# EAGLE schematic schematicEagle (EAGLE 9.6.2)
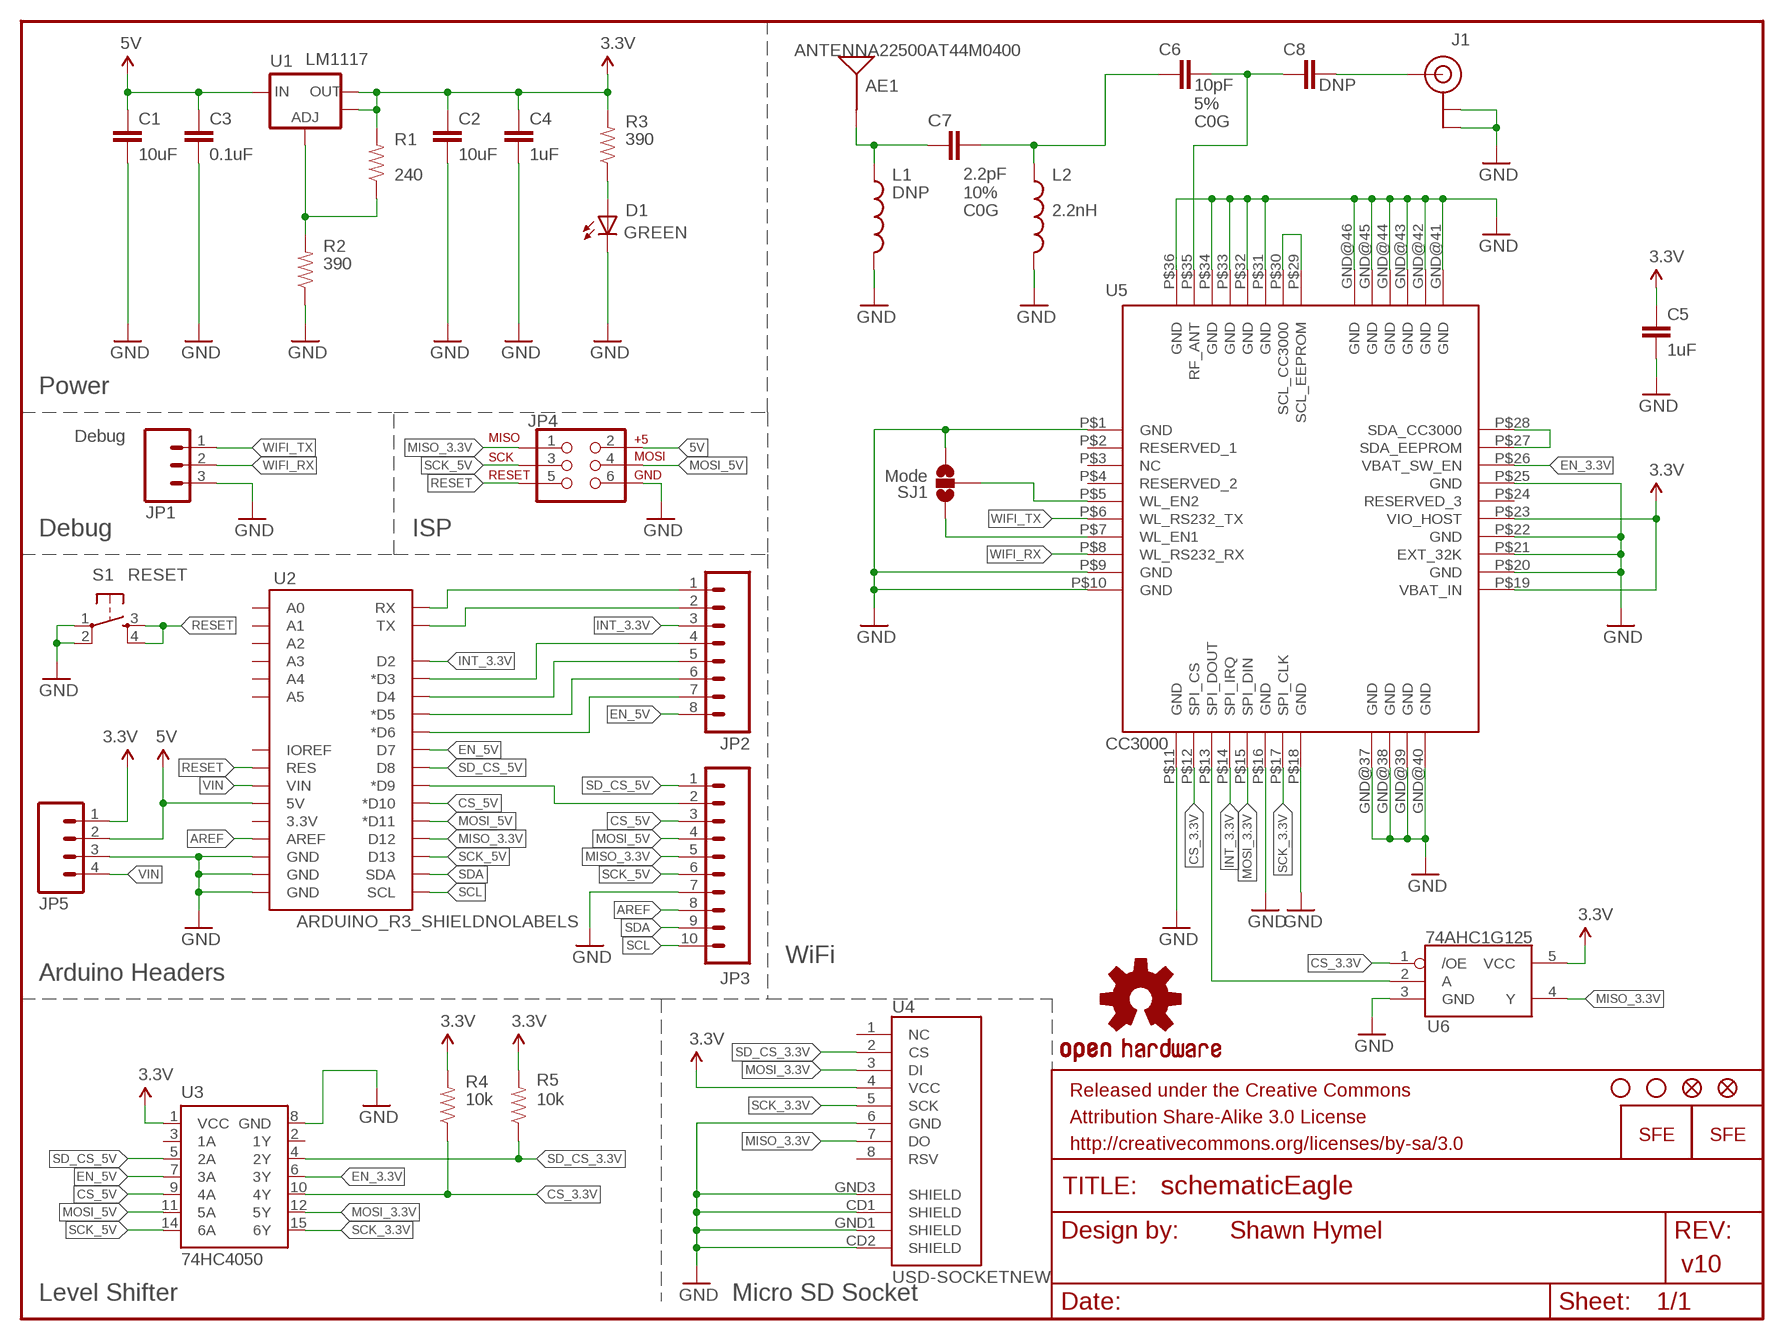
[diagram p0: schematic, sheet 1]

## Parts
AE1  ANTENNA22500AT44M0400  [ANTENNA-CHIP_2500AT44M0400]
C1  10uF  CAP0805  [0805]
C2  10uF  CAP0805  [0805]
C3  0.1uF  CAP0603-CAP  [0603-CAP]
C4  1uF  CAP0805  [0805]
C5  1uF  CAP0805  [0805]
C6  10pF  CAP0603-CAP  [0603-CAP]
C7  2.2pF  CAP0603-CAP  [0603-CAP]
C8  DNP  CAP0603-CAP  [0603-CAP]
D1  GREEN  LED-GREEN0603  [LED-0603]
FID1  FIDUCIAL1X2  [FIDUCIAL-1X2]
FID2  FIDUCIAL1X2  [FIDUCIAL-1X2]
FRAME1  FRAME-LETTER  [CREATIVE_COMMONS]
J1  U.FL  [U.FL]
JP1  Debug  M03PTH  [1X03]
JP2  M08NO_SILK  [1X08_NO_SILK]
JP3  M10NO_SILK  [1X10_NO_SILK]
JP4  AVR_SPI_PRG_6PTH  [2X3]
JP5  M04PTH  [1X04]
L1  DNP  INDUCTOR0603  [0603]
L2  2.2nH  INDUCTOR0603  [0603]
LOGO1  OSHW-LOGOS  [OSHW-LOGO-S]
LOGO2  LOGO-SFENEW  [SFE-NEW-WEBLOGO]
LOGO3  LOGO-SFESK  [SFE-LOGO-FLAME]
R1  240  RESISTOR0603  [0603-RES]
R2  390  RESISTOR0603  [0603-RES]
R3  390  RESISTOR0603-RES  [0603-RES]
R4  10k  RESISTOR0603-RES  [0603-RES]
R5  10k  RESISTOR0603-RES  [0603-RES]
S1  RESET  TAC_SWITCHSMD  [TACTILE_SWITCH_SMD]
SJ1  Mode  SOLDERJUMPER_2WAYPASTE1&2  [SJ_3_PASTE1&2]
STANDOFF1  STAND-OFF  [STAND-OFF]
STANDOFF2  STAND-OFF  [STAND-OFF]
U1  LM1117  V_REG_LM1117SOT223  [SOT223]
U2  ARDUINO_R3_SHIELDNOLABELS  [UNO_R3_SHIELD_NOLABELS]
U3  74HC4050  HEX_CONVERTER  [SO016]
U4  USD-SOCKETNEW  [MICRO-SD-SOCKET-PP]
U5  CC3000  [QFN-46_CC3000]
U6  74AHC1G125  [SOT23-5]

## Nets
3.3V: C2.1 C4.1 C5.1 JP5.1 R1.2 R3.2 R4.2 R5.2 U1.2(OUT) U1.4(OUT) U3.1(VCC) U4.4(VCC) U5.P$19(VBAT_IN) U5.P$23(VIO_HOST) U6.5(VCC)
5V: C1.1 C3.1 JP4.2 JP5.2 U1.3(IN) U2.5V
AREF: JP3.8 U2.AREF
CS_3.3V: R4.1 U3.10(4Y) U5.P$12(SPI_CS) U6.1(/OE)
CS_5V: JP3.3 U2.D10(*D10) U3.9(4A)
EN_3.3V: U3.6(3Y) U5.P$26(VBAT_SW_EN)
EN_5V: JP2.8 U2.D7 U3.7(3A)
GND: C1.2 C2.2 C3.2 C4.2 C5.2 D1.C J1.P$1(GND) J1.P$2(GND) JP1.3 JP3.7 JP4.6 JP5.3 L1.2 L2.2 R2.1 S1.1 S1.2 SJ1.3 U2.GND@0(GND) U2.GND@1(GND) U2.GND@2(GND) U3.8(GND) U4.6(GND) U4.CD1(SHIELD) U4.CD2(SHIELD) U4.GND1(SHIELD) U4.GND3(SHIELD) U5.GND@37(GND) U5.GND@38(GND) U5.GND@39(GND) U5.GND@40(GND) U5.GND@41(GND) U5.GND@42(GND) U5.GND@43(GND) U5.GND@44(GND) U5.GND@45(GND) U5.GND@46(GND) U5.P$1(GND) U5.P$9(GND) U5.P$10(GND) U5.P$11(GND) U5.P$16(GND) U5.P$18(GND) U5.P$20(GND) U5.P$21(EXT_32K) U5.P$22(GND) U5.P$25(GND) U5.P$31(GND) U5.P$32(GND) U5.P$33(GND) U5.P$34(GND) U5.P$36(GND) U6.3(GND)
INT_3.3V: JP2.3 U2.D2 U5.P$14(SPI_IRQ)
MISO_3.3V: JP3.5 JP4.1 U2.D12 U4.7(DO) U6.4(Y)
MOSI_3.3V: U3.12(5Y) U4.3(DI) U5.P$15(SPI_DIN)
MOSI_5V: JP3.4 JP4.4 U2.D11(*D11) U3.11(5A)
N$2: R1.1 R2.2 U1.1(ADJ)
N$3: SJ1.2 U5.P$5(WL_EN2)
N$4: SJ1.1 U5.P$7(WL_EN1)
N$5: C6.1 C7.2 L2.1
N$6: U5.P$27(SDA_EEPROM) U5.P$28(SDA_CC3000)
N$7: U5.P$29(SCL_EEPROM) U5.P$30(SCL_CC3000)
N$8: C6.2 C8.1 U5.P$35(RF_ANT)
N$9: C8.2 J1.P$3(SIGNAL)
N$10: AE1.FEED(SIGNAL) C7.1 L1.1
N$11: D1.A R3.1
N$125: JP2.1 U2.RX
N$126: JP2.2 U2.TX
N$127: JP2.4 U2.D3(*D3)
N$128: JP2.6 U2.D5(*D5)
N$129: JP2.7 U2.D6(*D6)
N$130: JP2.5 U2.D4
N$131: JP3.2 U2.D9(*D9)
RESET: JP4.5 S1.3 S1.4 U2.RES
SCK_3.3V: U3.15(6Y) U4.5(SCK) U5.P$17(SPI_CLK)
SCK_5V: JP3.6 JP4.3 U2.D13 U3.14(6A)
SCL: JP3.10 U2.SCL
SD_CS_3.3V: R5.1 U3.4(2Y) U4.2(CS)
SD_CS_5V: JP3.1 U2.D8 U3.5(2A)
SDA: JP3.9 U2.SDA
VIN: JP5.4 U2.VIN
WIFI_MISO: U5.P$13(SPI_DOUT) U6.2(A)
WIFI_RX: JP1.2 U5.P$8(WL_RS232_RX)
WIFI_TX: JP1.1 U5.P$6(WL_RS232_TX)
Unconnected: U2.3.3V U2.A0 U2.A1 U2.A2 U2.A3 U2.A4 U2.A5 U2.IOREF U3.2(1Y) U3.3(1A) U4.1(NC) U4.8(RSV) U5.P$2(RESERVED_1) U5.P$3(NC) U5.P$4(RESERVED_2) U5.P$24(RESERVED_3)

## Notes on the sheet
- Power
- Debug | ISP
- WiFi
- Arduino Headers
- Shawn Hymel
- v10
- Level Shifter | Micro SD Socket

## Library data of the parts
AE1 = SparkFun-RF:ANTENNA2: Chip antenna Single endded antenna. Common with smaller chip antennas. CHIP4 package is the GPS Chip Antenna SKU: GPS-08418. CHIP5 package is 2.4GHz chip antenna SKU: WRL-00144.
C1-C5 C8 = SparkFun-Capacitors:CAP: Capacitor Standard 0603 ceramic capacitor, and 0.1" leaded capacitor.
C6 = SparkFun-Capacitors:CAP: Capacitor Standard 0603 ceramic capacitor, and 0.1" leaded capacitor.; COEFF: C0G; TOL: 5%
C7 = SparkFun-Capacitors:CAP: Capacitor Standard 0603 ceramic capacitor, and 0.1" leaded capacitor.; COEFF: C0G; TOL: 10%
D1 = SparkFun-LED:LED-GREEN: Various green LEDs 0603- DIO-00821 LARGE- DIO-00862 LILYPAD- DIO-09910; PROD_ID: DIO-00821
FID1 FID2 = SparkFun-Aesthetics:FIDUCIAL: Fiducial Alignment Points Various fiducial points for machine vision alignment.
FRAME1 = SparkFun-Aesthetics:FRAME-LETTER: Schematic Frame Standard 8.5x11 US Letter frame
J1 = SparkFun-Connectors:U.FL: SMD antenna connector- WRL-09144
JP1 = SparkFun-Connectors:M03: Header 3 Standard 3-pin 0.1" header. Use with straight break away headers (SKU : PRT-00116), right angle break away headers (PRT-00553), swiss pins (PRT-00743), machine pins (PRT-00117), and female headers (PRT-00115). Molex polarized connector foot print use with SKU : PRT-08232 with associated crimp pins and housings.
JP2 = SparkFun-Connectors:M08: Header 8 Standard 8-pin 0.1" header. Use with straight break away headers (SKU : PRT-00116), right angle break away headers (PRT-00553), swiss pins (PRT-00743), machine pins (PRT-00117), and female headers (PRT-00115).
JP3 = SparkFun-Connectors:M10: Header 10 Standard 10-pin 0.1" header. Use with straight break away headers (SKU : PRT-00116), right angle break away headers (PRT-00553), swiss pins (PRT-00743), machine pins (PRT-00117), and female headers (PRT-00115).
JP4 = SparkFun-Connectors:AVR_SPI_PRG_6: AVR ISP 6 Pin This is the reduced ISP connector for AVR programming. Common on Arduino. This footprint will take up less PCB space and can be used with a 10-pin to 6-pin adapter such as SKU: BOB-08508
JP5 = SparkFun-Connectors:M04: Header 4 Standard 4-pin 0.1" header. Use with straight break away headers (SKU : PRT-00116), right angle break away headers (PRT-00553), swiss pins (PRT-00743), machine pins (PRT-00117), and female headers (PRT-00115). Molex polarized connector foot print use with SKU : PRT-08231 with associated crimp pins and housings. 1MM SMD Version SKU: PRT-10208
L1 L2 = SparkFun-Passives:INDUCTOR: Inductors Basic Inductor/Choke - 0603 and 1206. Footprints are not proven and vary greatly between part numbers. SRN6045- 33uH, 20% 1.4A SDR0403-560KL - 56uH, 10%, 500mA RMS/740mA peak
LOGO1 = SparkFun-Aesthetics:OSHW-LOGO: Open Source Hardware Logo This logo indicates the piece of hardware it is found on incorporates a OSHW license and/or adheres to the definition of open source hardware found here: http://freedomdefined.org/OSHW
LOGO2 LOGO3 = SparkFun-Aesthetics:LOGO-SFE: Spark Fun Electronics PCB Logo This is the standard Spark Fun Electronics PCB logo.
R1-R5 = SparkFun-Resistors:RESISTOR: Resistor Basic schematic elements and footprints for 0603, 1206, and PTH resistors.
S1 = SparkFun-Electromechanical:TAC_SWITCH: Momentary Switch Button commonly used for reset or general input. Spark Fun Electronics SKU : COM-00097 SMT- SWCH-08247; PROD_ID: SWCH-08247
SJ1 = SparkFun-Passives:SOLDERJUMPER_2WAY: Solder Jumper 2 way solder jumper
STANDOFF1 STANDOFF2 = SparkFun-Electromechanical:STAND-OFF: #4 Stand Off This is the mechanical footprint for a #4 phillips button head screw. Use the keepout ring to avoid running the screw head into surrounding components. SKU : PRT-00447
U1 = SparkFun-PowerIC:V_REG_LM1117: Voltage Regulator LM1117 Standard adjustable voltage regulator but in SMD form. Spark Fun Electronics SKU : COM-00595
U2 = SparkFun-Boards:ARDUINO_R3_SHIELD: Shield form compatible with the Arduino Uno R3.
U3 = SparkFun-DigitalIC:HEX_CONVERTER: Just what it says.
U4 = SparkFun-Connectors:USD-SOCKET: microSD Socket Push-push type uSD socket. Schematic element and footprint production proven. Spark Fun Electronics SKU : PRT-00127. tDoc lines correctly indicate media card edge positions when inserting (unlocked, locked, depressed).
U5 = SparkFun-RF:CC3000: TI CC3000 WiFi Module
U6 = SparkFun-DigitalIC:74AHC1G125: Single bus buffer gate with 3-state output